# Altium schematic sheet MFX & LEDs.SchDoc: MFX & LEDs
size A4; DocumentNumber: MB1219; Revision: B.1; SheetNumber: 16; SheetTotal: 17; Project: STM32F769I-EVAL
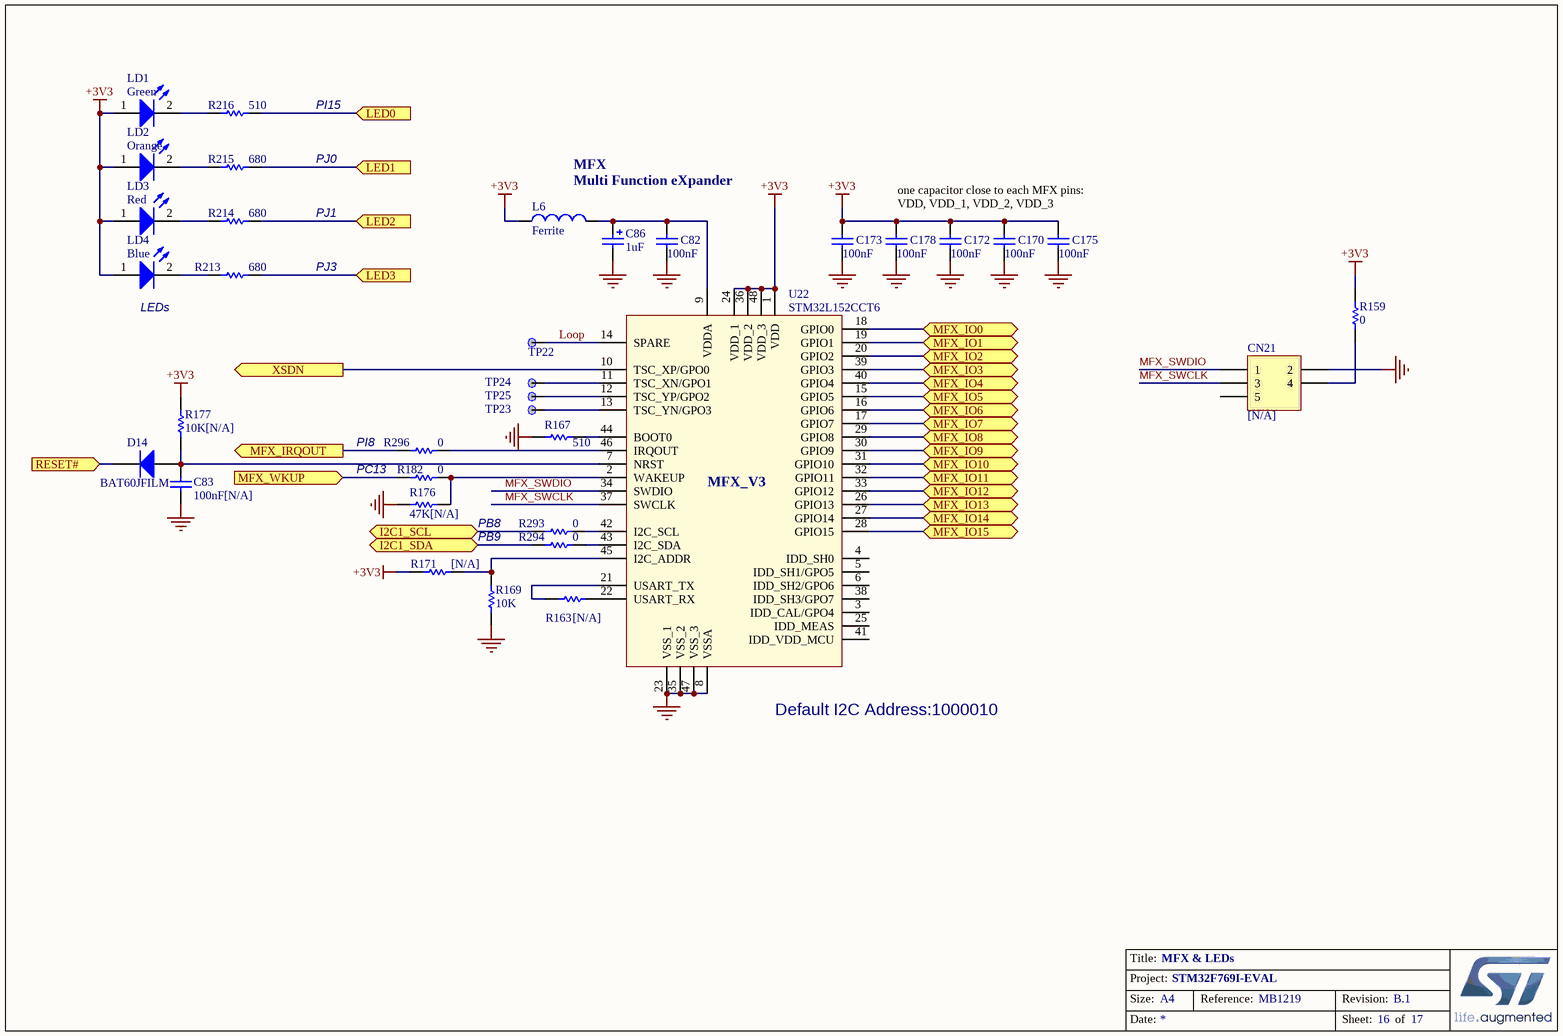
[diagram p0: MFX & LEDs.SchDoc]

## Parts
C82  100nF  [0402C]
C83  100nF[N/A]  [0402C]
C86  1uF  [TAN-A]
C170  100nF  [0402C]
C172  100nF  [0402C]
C173  100nF  [0402C]
C175  100nF  [0402C]
C178  100nF  [0402C]
CN21  [N/A]  [HDR_2X3-1_2R54-6]
D14  BAT60JFILM  [SOD-323]
L6  Ferrite  [0603L]
LD1  Green  [0603D]
LD2  Orange  [0603D]
LD3  Red  [0603D]
LD4  Blue  [0603D]
R159  0  [0603R]
R163  [N/A]  [0603R]
R167  510  [0402R]
R169  10K  [0402R]
R171  [N/A]  [0603R]
R176  47K[N/A]  [0402R]
R177  10K[N/A]  [0402R]
R182  0  [0603R]
R213  680  [0603R]
R214  680  [0603R]
R215  680  [0603R]
R216  510  [0603R]
R293  0  [0603R]
R294  0  [0603R]
R296  0  [0603R]
TP22  (no value)  [TP]
TP23  (no value)  [TP]
TP24  (no value)  [TP]
TP25  (no value)  [TP]
U22  STM32L152CCT6  [LQFP48_0R5_9X9]

## Ports
I2C1_SCL (bidir), I2C1_SDA (bidir), LED0 (in), LED1 (in), LED2 (in), LED3 (in), MFX_IO0 (bidir), MFX_IO1 (bidir), MFX_IO2 (bidir), MFX_IO3 (bidir), MFX_IO4 (bidir), MFX_IO5 (bidir), MFX_IO6 (bidir), MFX_IO7 (bidir), MFX_IO8 (bidir), MFX_IO9 (bidir), MFX_IO10 (bidir), MFX_IO11 (bidir), MFX_IO12 (bidir), MFX_IO13 (bidir), MFX_IO14 (bidir), MFX_IO15 (bidir), MFX_IRQOUT (out), MFX_WKUP (in), RESET# (in), XSDN (out)

## Nets
+3V3: C170.2 C172.1 C173.2 C175.2 C178.2 L6.1 LD1.1(A) LD2.1(A) LD3.1(A) LD4.1(A) R159.1 R171.2 R177.2 U22.1(VDD) U22.24(VDD_1) U22.36(VDD_2) U22.48(VDD_3)
GND: C82.1 C83.1 C86.2 C170.1 C172.2 C173.1 C175.1 C178.1 CN21.2 R167.2 R169.2 R176.1 U22.8(VSSA) U22.23(VSS_1) U22.35(VSS_2) U22.47(VSS_3)
I2C1_SCL: R293.1 ; port I2C1_SCL
I2C1_SDA: R294.1 ; port I2C1_SDA
LED0: R216.1 ; port LED0
LED1: R215.1 ; port LED1
LED2: R214.1 ; port LED2
LED3: R213.1 ; port LED3
Loop: TP22.1 U22.14(SPARE)
MFX_IO0: U22.18(GPIO0) ; port MFX_IO0
MFX_IO1: U22.19(GPIO1) ; port MFX_IO1
MFX_IO2: U22.20(GPIO2) ; port MFX_IO2
MFX_IO3: U22.39(GPIO3) ; port MFX_IO3
MFX_IO4: U22.40(GPIO4) ; port MFX_IO4
MFX_IO5: U22.15(GPIO5) ; port MFX_IO5
MFX_IO6: U22.16(GPIO6) ; port MFX_IO6
MFX_IO7: U22.17(GPIO7) ; port MFX_IO7
MFX_IO8: U22.29(GPIO8) ; port MFX_IO8
MFX_IO9: U22.30(GPIO9) ; port MFX_IO9
MFX_IO10: U22.31(GPIO10) ; port MFX_IO10
MFX_IO11: U22.32(GPIO11) ; port MFX_IO11
MFX_IO12: U22.33(GPIO12) ; port MFX_IO12
MFX_IO13: U22.26(GPIO13) ; port MFX_IO13
MFX_IO14: U22.27(GPIO14) ; port MFX_IO14
MFX_IO15: U22.28(GPIO15) ; port MFX_IO15
MFX_IRQOUT: R296.1 ; port MFX_IRQOUT
MFX_SWCLK: CN21.3 U22.37(SWCLK)
MFX_SWDIO: CN21.1 U22.34(SWDIO)
MFX_WKUP: R182.2 ; port MFX_WKUP
RESET#: D14.2(K) ; port RESET#
XSDN: U22.10(TSC_XP/GPO0) ; port XSDN
NetC82_2: C82.2 C86.1 L6.2 U22.9(VDDA)
NetC83_2: C83.2 D14.1(A) R177.1 U22.7(NRST)
NetCN21_4: CN21.4 R159.2
NetLD1_2: LD1.2(K) R216.2
NetLD2_2: LD2.2(K) R215.2
NetLD3_2: LD3.2(K) R214.2
NetLD4_2: LD4.2(K) R213.2
NetR163_1: R163.1 U22.21(USART_TX)
NetR163_2: R163.2 U22.22(USART_RX)
NetR167_1: R167.1 U22.44(BOOT0)
NetR169_1: R169.1 R171.1 U22.45(I2C_ADDR)
NetR176_2: R176.2 R182.1 U22.2(WAKEUP)
NetR293_2: R293.2 U22.42(I2C_SCL)
NetR294_2: R294.2 U22.43(I2C_SDA)
NetR296_2: R296.2 U22.46(IRQOUT)
NetTP23_1: TP23.1 U22.13(TSC_YN/GPO3)
NetTP24_1: TP24.1 U22.11(TSC_XN/GPO1)
NetTP25_1: TP25.1 U22.12(TSC_YP/GPO2)

Not connected (* = marked no-connect by the designer): CN21 5; U22 3(IDD_CAL/GPO4) 4(IDD_SH0) 5(IDD_SH1/GPO5) 6(IDD_SH2/GPO6) 25(IDD_MEAS) 38(IDD_SH3/GPO7) 41(IDD_VDD_MCU)

## Notes on the sheet
- PI15
- PJ0
- PJ1
- MFX
  Multi Function eXpander
- one capacitor close to each MFX pins: VDD, VDD_1, VDD_2, VDD_3
- (near LD4) LEDs
- PJ3
- PI8
- PC13
- PB8
- PB9
- (near U22) Default I2C Address:1000010
- Title:
- Project:
- Size:
- Date:
- A4
- Reference:
- Sheet:
- Revision:
- of
- (in symbol MFX) MFX_V3

## Library data of the parts
C82 C83 C170 C172 C173 C175 C178 = Cap_100nF_X7R_10%_0402: Capacitor,100nF,16V,X7R,10%,0402,YAGEO; Manuf_Part_1: CC0402KRX7R7BB104; Revision: July-2002: Re-released for DXP Platform.; Value: 100nF; Order: CC0402KRX7R7BB104; Manuf_1: YAGEO
C86 = Cap_1uF_POL_10%_TANA: Polarized Capacitor,1uF,16V,10%,typeA,AVX; Manuf_Part_1: TAJA105K016R; Revision: July-2002: Re-released for DXP Platform.; Value: 1uF; Order: TAJA105K016R; Manuf_1: AVX; Distrib: *
CN21 = Header 3X2: Header, 3-Pin, Dual row; Revision: 17-Jul-2002: Re-released for DXP Platform.; Publisher: Altium Limited
D14 = Diode: Default Diode; Code - JEDEC: DO-214-AB; Published: 8-Jun-2000; Revision: July-2002: Re-released for DXP Platform.; Publisher: Altium Limited
L6 = BEAD_600R_350MA_0603: Bead,600R,350mA,0603,FCM1608KF-601T03,Tai-tech; Manuf_2: TDK; Manuf_Part_2: MPZ1608S300A; Value: 100uH; Comment_1: bead,30R,5A,0603,MPZ1608S300A,TDK; Revision: July-2002: Re-released for DXP Platform.; Manuf_Part_1: FCM1608KF-601T03; Order: FCM1608KF-601T03; Manuf_1: Tai-tech
LD1-LD4 = LED2: Typical RED, GREEN, YELLOW, AMBER GaAs LED; Published: 8-Jun-2000; Revision: July-2002: Re-released for DXP Platform.; Publisher: Altium Limited
R159 R293 R294 R296 = Res1: Resistor; Value: 1K; Ordered by: Subcon; Published: 8-Jun-2000; Revision: July-2002: Re-released for DXP Platform.; Publisher: Altium Limited
R163 = res1: Resistor; Value: 1K; Ordered by: Subcon; Published: 8-Jun-2000; Revision: July-2002: Re-released for DXP Platform.; Publisher: Altium Limited
R167 R176 R177 = Resistor_ST: Resistor 0402 / 0603 / 0805; Description: Resistor 0402 or 0603 or 0805; Value: 10K
R169 = Resistor_ST: Resistor 0402 / 0603 / 0805; Description: Resistor 0402 or 0603 or 0805; Value: 10K
R171 R182 R213-R216 = Res1: Resistor; Value: 1K; Published: 8-Jun-2000; Revision: July-2002: Re-released for DXP Platform.; Publisher: Altium Limited
TP22-TP25 = TP
U22 = MFX: Multifunction expander